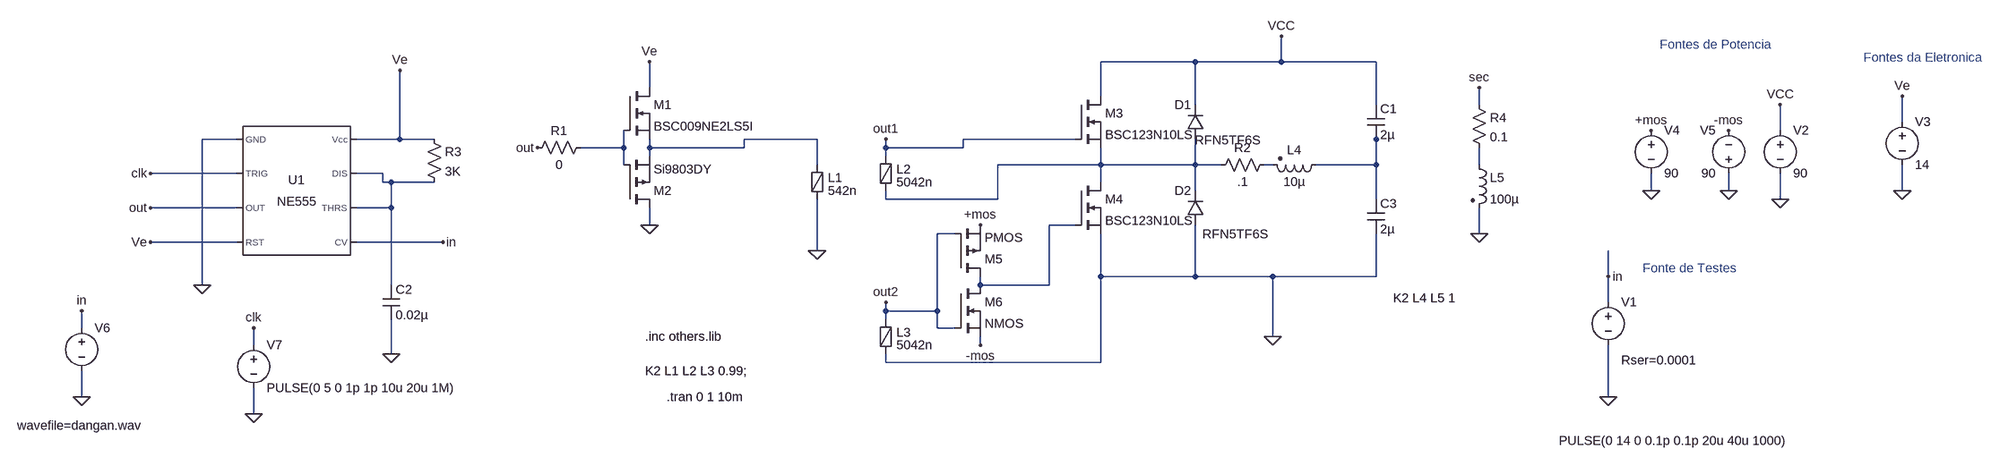
[diagram p0: schematic gdt1.asc]
gdt1.asc, the LTspice schematic file:
Version 4
SHEET 1 2744 680
WIRE 768 -96 592 -96
WIRE 928 -96 928 -144
WIRE 928 -96 768 -96
WIRE 1104 -96 928 -96
WIRE -256 -48 -256 -96
WIRE 592 -32 592 -96
WIRE 768 -16 768 -96
WIRE 1104 -16 1104 -96
WIRE 1296 -16 1296 -48
WIRE 2128 16 2128 -32
WIRE 1856 32 1856 -16
WIRE -1056 48 -1120 48
WIRE -752 48 -752 -80
WIRE -752 48 -832 48
WIRE -688 48 -752 48
WIRE 64 48 -80 48
WIRE 544 48 336 48
WIRE 1104 48 1104 32
WIRE -304 64 -304 32
WIRE -304 64 -384 64
WIRE -256 64 -256 48
WIRE -80 64 -80 48
WIRE -80 64 -256 64
WIRE 192 64 192 48
WIRE 336 64 336 48
WIRE 336 64 192 64
WIRE -256 80 -256 64
WIRE 192 80 192 64
WIRE -304 96 -304 64
WIRE 64 96 64 48
WIRE 592 96 592 64
WIRE 592 96 400 96
WIRE 768 96 768 48
WIRE 768 96 592 96
WIRE 816 96 768 96
WIRE 912 96 896 96
WIRE 1104 96 1104 48
WIRE 1104 96 992 96
WIRE 1296 96 1296 64
WIRE -1056 112 -1216 112
WIRE -784 112 -832 112
WIRE -784 128 -784 112
WIRE -768 128 -784 128
WIRE -688 128 -768 128
WIRE 592 128 592 96
WIRE 768 144 768 96
WIRE 1616 144 1616 112
WIRE 1760 144 1760 112
WIRE 2128 144 2128 96
WIRE 192 160 192 144
WIRE 400 160 400 96
WIRE 400 160 192 160
WIRE 1104 160 1104 96
WIRE 1856 160 1856 112
WIRE -1056 176 -1216 176
WIRE -768 176 -768 128
WIRE -768 176 -832 176
WIRE -256 208 -256 176
WIRE 544 208 496 208
WIRE 320 224 288 224
WIRE 1296 224 1296 176
WIRE -1056 240 -1216 240
WIRE -672 240 -832 240
WIRE 64 256 64 160
WIRE 592 304 592 224
WIRE 768 304 768 208
WIRE 768 304 592 304
WIRE 912 304 768 304
WIRE 1104 304 1104 224
WIRE 1104 304 912 304
WIRE 1536 304 1536 256
WIRE -1120 320 -1120 48
WIRE -768 320 -768 176
WIRE 368 320 368 304
WIRE 496 320 496 208
WIRE 496 320 368 320
WIRE 1536 352 1536 304
WIRE 192 368 192 352
WIRE 288 368 288 224
WIRE 288 368 192 368
WIRE 192 384 192 368
WIRE -1344 400 -1344 368
WIRE 288 400 288 368
WIRE 320 400 288 400
WIRE 912 416 912 304
WIRE -1024 432 -1024 400
WIRE 368 432 368 416
WIRE -768 448 -768 384
WIRE 192 464 192 448
WIRE 592 464 592 304
WIRE 592 464 192 464
WIRE -1344 528 -1344 480
WIRE 1536 528 1536 432
WIRE -1024 560 -1024 512
FLAG 1536 528 0
FLAG 192 48 out1
FLAG 192 352 out2
FLAG 1856 160 0
FLAG 1856 -16 VCC
FLAG 1536 304 in
FLAG 2128 144 0
FLAG 2128 -32 Ve
FLAG -256 208 0
FLAG -256 -96 Ve
FLAG 912 416 0
FLAG 928 -144 VCC
FLAG 64 256 0
FLAG 1616 144 0
FLAG 1760 144 0
FLAG 1616 32 +mos
FLAG 1760 32 -mos
FLAG 368 208 +mos
FLAG 368 432 -mos
FLAG 1296 224 0
FLAG 1296 -48 sec
FLAG -1120 320 0
FLAG -752 -80 Ve
FLAG -768 448 0
FLAG -672 240 in
FLAG -1216 240 Ve
FLAG -464 64 out
FLAG -1216 176 out
FLAG -1216 112 clk
FLAG -1024 560 0
FLAG -1344 528 0
FLAG -1024 400 clk
FLAG -1344 368 in
SYMBOL voltage 1536 336 R0
WINDOW 3 -92 274 Left 2
WINDOW 123 0 0 Left 0
WINDOW 39 24 124 Left 2
SYMATTR Value PULSE(0 14 0 0.1p 0.1p 20u 40u 1000)
SYMATTR SpiceLine Rser=0.0001
SYMATTR InstName V1
SYMBOL FerriteBead 64 128 R0
SYMATTR InstName L1
SYMATTR Value 542n
SYMATTR SpiceLine Ipk=4 Rser=0.0103 Rpar=277.6 Cpar=240.8p mfg="Würth Elektronik" pn="74279224171 WE-MPSB 2220"
SYMBOL FerriteBead 192 112 R0
SYMATTR InstName L2
SYMATTR Value 5042n
SYMATTR SpiceLine Ipk=4 Rser=0.0103 Rpar=277.6 Cpar=240.8p
SYMBOL FerriteBead 192 416 R0
SYMATTR InstName L3
SYMATTR Value 5042n
SYMATTR SpiceLine Ipk=4 Rser=0.0103 Rpar=277.6 Cpar=240.8p
SYMBOL voltage 1856 16 R0
WINDOW 123 0 0 Left 0
WINDOW 39 0 0 Left 0
SYMATTR InstName V2
SYMATTR Value 90
SYMBOL voltage 2128 0 R0
WINDOW 123 0 0 Left 0
WINDOW 39 0 0 Left 0
SYMATTR InstName V3
SYMATTR Value 14
SYMBOL diode 784 48 R180
WINDOW 0 24 64 Left 2
WINDOW 3 -105 -2 Left 2
SYMATTR InstName D1
SYMATTR Value RFN5TF6S
SYMBOL diode 784 208 R180
WINDOW 0 24 64 Left 2
WINDOW 3 -119 -17 Left 2
SYMATTR InstName D2
SYMATTR Value RFN5TF6S
SYMBOL cap 1088 -16 R0
SYMATTR InstName C1
SYMATTR Value 2µ
SYMBOL cap 1088 160 R0
SYMATTR InstName C3
SYMATTR Value 2µ
SYMBOL nmos 544 -32 R0
SYMATTR InstName M3
SYMATTR Value BSC123N10LS
SYMBOL nmos 544 128 R0
SYMATTR InstName M4
SYMATTR Value BSC123N10LS
SYMBOL res -368 48 R90
WINDOW 0 0 56 VBottom 2
WINDOW 3 32 56 VTop 2
SYMATTR InstName R1
SYMATTR Value 0
SYMBOL nmos -304 -48 R0
SYMATTR InstName M1
SYMATTR Value BSC009NE2LS5I
SYMBOL pmos -304 176 M180
SYMATTR InstName M2
SYMATTR Value Si9803DY
SYMBOL voltage 1616 16 R0
WINDOW 123 0 0 Left 0
WINDOW 39 0 0 Left 0
SYMATTR InstName V4
SYMATTR Value 90
SYMBOL voltage 1760 128 R180
WINDOW 0 24 96 Left 2
WINDOW 3 24 16 Left 2
WINDOW 123 0 0 Left 0
WINDOW 39 0 0 Left 0
SYMATTR InstName V5
SYMATTR Value 90
SYMBOL nmos 320 320 R0
SYMATTR InstName M6
SYMBOL pmos 320 304 M180
SYMATTR InstName M5
SYMBOL ind2 1008 80 R90
WINDOW 0 4 56 VBottom 2
WINDOW 3 32 56 VTop 2
SYMATTR InstName L4
SYMATTR Value 10µ
SYMBOL ind2 1280 80 R0
SYMATTR InstName L5
SYMATTR Value 100µ
SYMBOL res 912 80 R90
WINDOW 0 0 56 VBottom 2
WINDOW 3 32 56 VTop 2
SYMATTR InstName R2
SYMATTR Value .1
SYMBOL Misc\\NE555 -944 144 R0
SYMATTR InstName U1
SYMBOL res -704 32 R0
SYMATTR InstName R3
SYMATTR Value 3K
SYMBOL cap -784 320 R0
SYMATTR InstName C2
SYMATTR Value 0.02µ
SYMBOL voltage -1344 384 R0
WINDOW 3 -120 198 Left 2
WINDOW 123 0 0 Left 0
WINDOW 39 0 0 Left 0
SYMATTR Value wavefile=dangan.wav
SYMATTR InstName V6
SYMBOL voltage -1024 416 R0
WINDOW 123 0 0 Left 0
WINDOW 39 0 0 Left 0
SYMATTR InstName V7
SYMATTR Value PULSE(0 5 0 1p 1p 10u 20u 1M)
SYMBOL res 1280 -32 R0
SYMATTR InstName R4
SYMATTR Value 0.1
TEXT -264 480 Left 2 !K2 L1 L2 L3 0.99;
TEXT -224 528 Left 2 !.tran 0 1 10m
TEXT -264 416 Left 2 !.inc others.lib
TEXT 1136 344 Left 2 !K2 L4 L5 1
TEXT 1632 -128 Left 2 ;Fontes de Potencia
TEXT 2056 -104 Left 2 ;Fontes da Eletronica
TEXT 1600 288 Left 2 ;Fonte de Testes

The netlist it stands for:
* gdt1.asc
V1 in 0 PULSE(0 14 0 0.1p 0.1p 20u 40u 1000) Rser=0.0001
L1 N001 0 542n Ipk=4 Rser=0.0103 Rpar=277.6 Cpar=240.8p mfg="Würth Elektronik" pn="74279224171 WE-MPSB 2220"
L2 out1 N004 5042n Ipk=4 Rser=0.0103 Rpar=277.6 Cpar=240.8p
L3 out2 0 5042n Ipk=4 Rser=0.0103 Rpar=277.6 Cpar=240.8p
V2 VCC 0 90
V3 Ve 0 14
D1 N004 VCC RFN5TF6S
D2 0 N004 RFN5TF6S
C1 VCC N002 2µ
C3 N002 0 2µ
M3 VCC out1 N004 N004 BSC123N10LS
M4 N004 N008 0 0 BSC123N10LS
R1 N003 out 0
M1 Ve N003 N001 N001 BSC009NE2LS5I
M2 0 N003 N001 N001 Si9803DY
V4 +mos 0 90
V5 0 -mos 90
M6 N008 out2 -mos -mos NMOS
M5 N008 out2 +mos +mos PMOS
L4 N002 N005 10µ
L5 N006 0 100µ
R2 N005 N004 .1
XU1 0 clk out Ve in N007 N007 Ve NE555  ; pins GND TRIG OUT RST CV THRS DIS Vcc
R3 Ve N007 3K
C2 N007 0 0.02µ
V6 in 0 wavefile=dangan.wav
V7 clk 0 PULSE(0 5 0 1p 1p 10u 20u 1M)
R4 sec N006 0.1
.model D D
.lib standard.dio
.model NMOS NMOS
.model PMOS PMOS
.lib standard.mos
K2 L1 L2 L3 0.99;
.tran 0 1 10m
.inc others.lib
K2 L4 L5 1
* Fontes de Potencia
* Fontes da Eletronica
* Fonte de Testes
.lib NE555.sub
.backanno
.end